# EasyEDA Pro project ProProject_单路无刷驱动版 BLDC_2023-12-23.epro, schematic Schematic1_4

## Sheets
1 CTRL
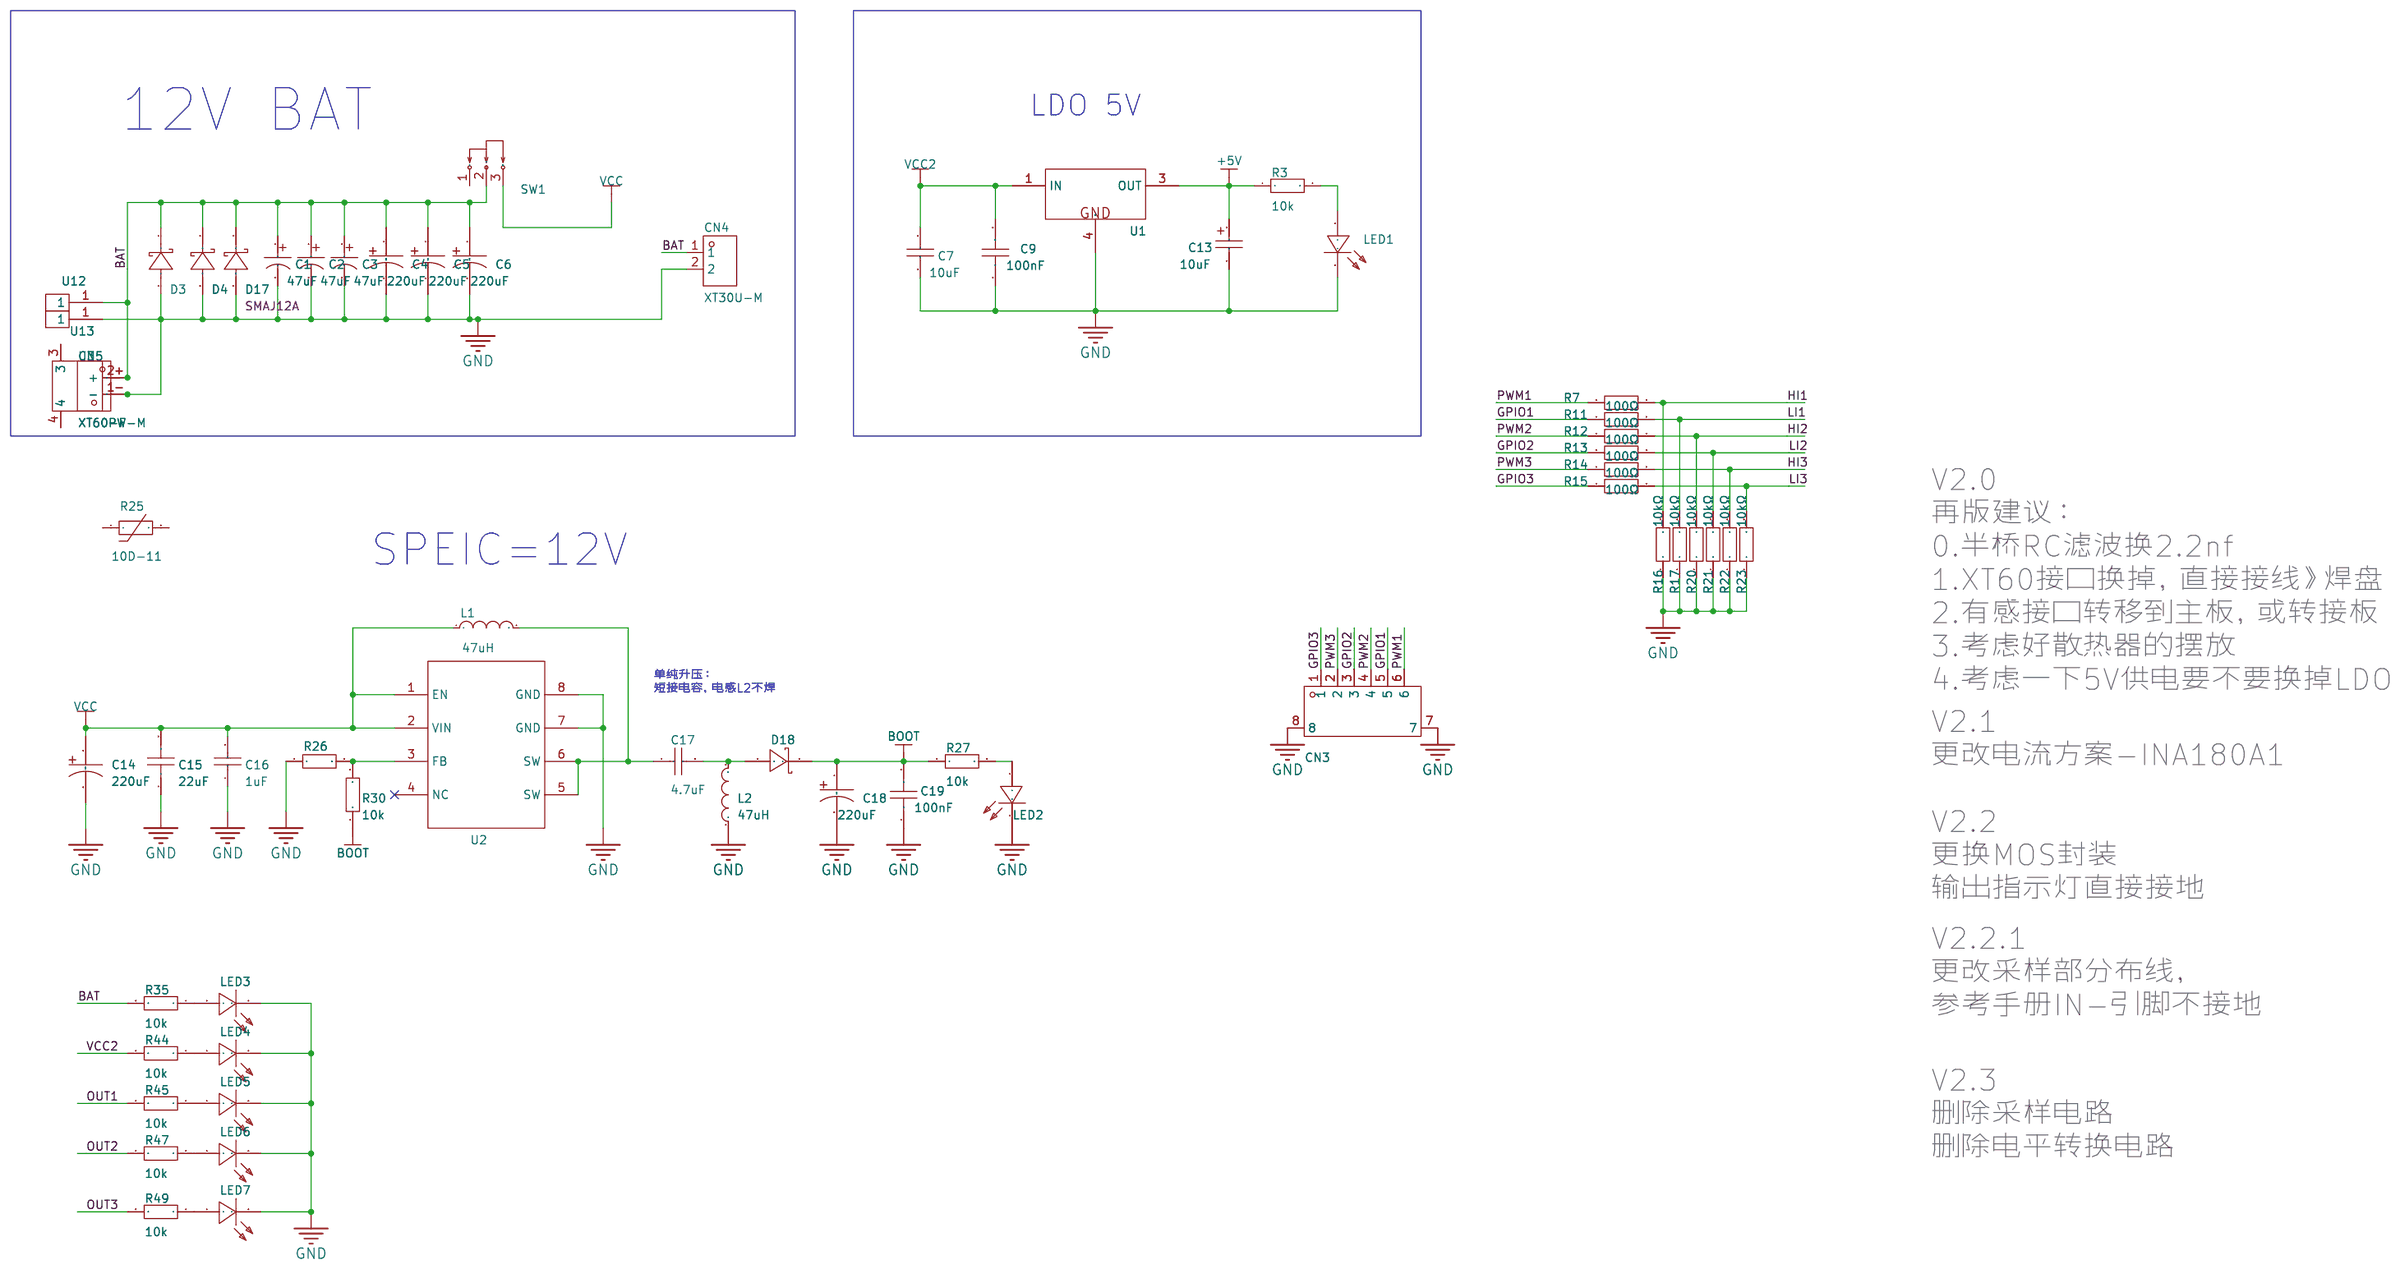
[diagram p0: CTRL]
2 PWR
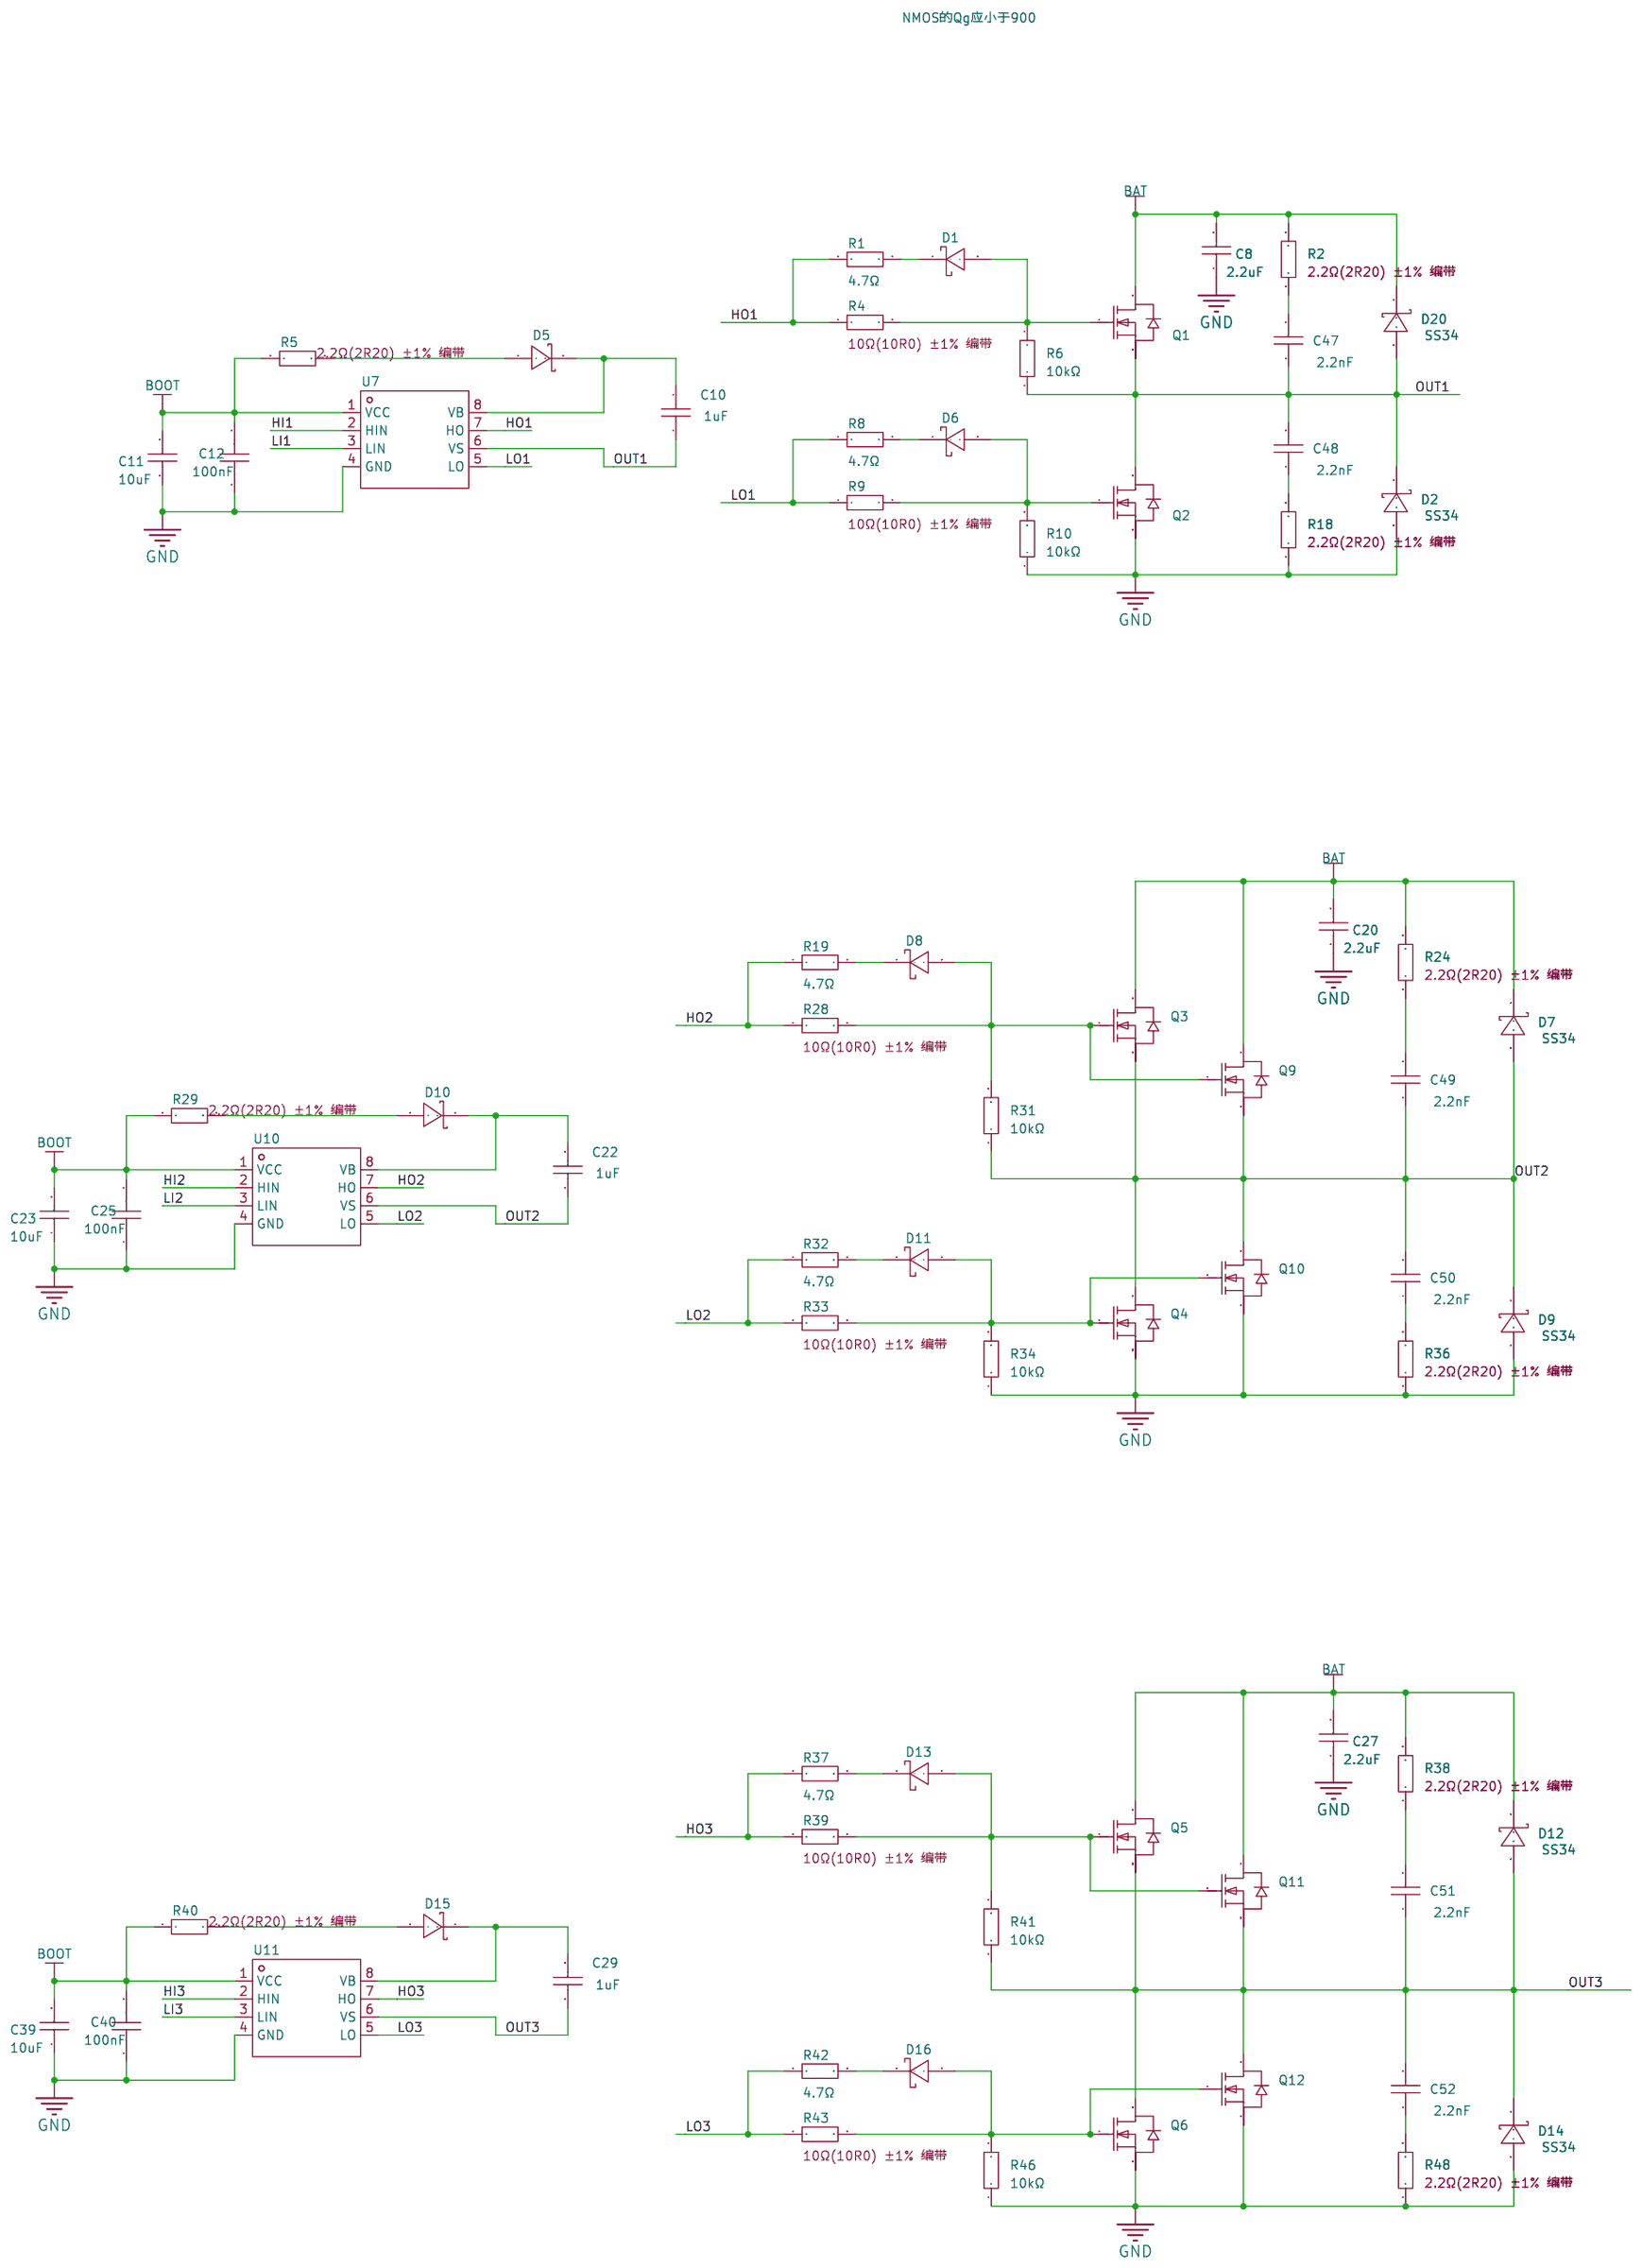
[diagram p1: PWR]

## Parts
sheet CTRL
C1  47uF  [CAP-TH_BD6.3-P2.50-D0.5-FD]
C2  47uF  [CAP-TH_BD6.3-P2.50-D0.5-FD]
C3  47uF  [CAP-TH_BD6.3-P2.50-D0.5-FD]
C4  220uF  [CAP-TH_BD8.0-P3.50-D0.6-FD]  (no BOM)
C5  220uF  [CAP-TH_BD8.0-P3.50-D0.6-FD]  (no BOM)
C6  220uF  [CAP-TH_BD8.0-P3.50-D0.6-FD]  (no BOM)
C7  10uF  [C0805]
C9  100nF  [C0603_1]
C13  10uF  [CAP-SMD_L3.2-W1.6-RD-C7171]
C14  220uF  [CAP-TH_BD8.0-P3.50-D0.6-FD]  (no BOM)
C15  22uF  [C0805]
C16  1uF  [C0603]
C17  4.7uF  [C1206]
C18  220uF  [CAP-TH_BD8.0-P3.50-D0.6-FD]  (no BOM)
C19  100nF  [C0603_1]
CN3  KH-ZH1.5WF-06A  [CONN-SMD_KH-ZH1.5WF-06A]
CN4  XT30U-M  [CONN-TH_XT30U-M]
CN5  XT60PW-M  [CONN-TH_XT60PW-M]
D3  SMAJ12A  [DO-214AC_L4.3-W2.7-LS5.0-RD]  (no BOM)
D4  SMAJ12A  [DO-214AC_L4.3-W2.7-LS5.0-RD]  (no BOM)
D17  SMAJ12A  [DO-214AC_L4.3-W2.7-LS5.0-RD]  (no BOM)
D18  SS210  [SMA_L4.3-W2.6-LS5.2-RD]
L1  47uH  [IND-SMD_L7.3-W6.6]  (no BOM)
L2  47uH  [IND-SMD_L7.3-W6.6]  (no BOM)
LED1  KT-0603R  [LED0603-R-RD]
LED2  KT-0603R  [LED0603-R-RD]
LED3  KT-0603R  [LED0603-R-RD]
LED4  KT-0603R  [LED0603-R-RD]
LED5  KT-0603R  [LED0603-R-RD]
LED6  KT-0603R  [LED0603-R-RD]
LED7  KT-0603R  [LED0603-R-RD]
R3  10k  [R0603]
R7  100Ω  [R0603]
R11  100Ω  [R0603]
R12  100Ω  [R0603]
R13  100Ω  [R0603]
R14  100Ω  [R0603]
R15  100Ω  [R0603]
R16  10kΩ  [R0603]
R17  10kΩ  [R0603]
R20  10kΩ  [R0603]
R21  10kΩ  [R0603]
R22  10kΩ  [R0603]
R23  10kΩ  [R0603]
R25  10D-11  [10D-11自制]
R26  0603WAF1201T5E  [R0603]
R27  10k  [R0603]
R30  10k  [R0603]
R35  10k  [R0603]
R44  10k  [R0603]
R45  10k  [R0603]
R47  10k  [R0603]
R49  10k  [R0603]
SW1  SS12D10G4 071  [SW-TH_SHOU-HAN_SS12D10G4]
U1  L78M05ABDT-TR  [TO-252-2_L6.5-W6.1-P4.58-LS10.0-TL]
U2  XL6007E1  [SOIC-8_L5.0-W4.0-P1.27-LS6.0-BL]  (no BOM)
U3  XT60-F  [CONN-TH_XT60PB-F]
U12  -  [焊盘]
U13  -  [焊盘]
sheet PWR
C8  2.2uF  [C0805]
C10  1uF  [C0805]
C11  10uF  [C0805]
C12  100nF  [C0603_1]
C20  2.2uF  [C0805]
C22  1uF  [C0805]
C23  10uF  [C0805]
C25  100nF  [C0603_1]
C27  2.2uF  [C0805]
C29  1uF  [C0805]
C39  10uF  [C0805]
C40  100nF  [C0603_1]
C47  2.2nF  [C0603]
C48  2.2nF  [C0603]
C49  2.2nF  [C0603]
C50  2.2nF  [C0603]
C51  2.2nF  [C0603]
C52  2.2nF  [C0603]
D1  B5819W SL  [SOD-123_L2.7-W1.6-LS3.7-RD-1]
D2  SS34  [DO-214AC_L4.3-W2.7-LS5.3-RD]
D5  SS210  [SMA_L4.3-W2.6-LS5.2-RD]
D6  B5819W SL  [SOD-123_L2.7-W1.6-LS3.7-RD-1]
D7  SS34  [DO-214AC_L4.3-W2.7-LS5.3-RD]
D8  B5819W SL  [SOD-123_L2.7-W1.6-LS3.7-RD-1]
D9  SS34  [DO-214AC_L4.3-W2.7-LS5.3-RD]
D10  SS210  [SMA_L4.3-W2.6-LS5.2-RD]
D11  B5819W SL  [SOD-123_L2.7-W1.6-LS3.7-RD-1]
D12  SS34  [DO-214AC_L4.3-W2.7-LS5.3-RD]
D13  B5819W SL  [SOD-123_L2.7-W1.6-LS3.7-RD-1]
D14  SS34  [DO-214AC_L4.3-W2.7-LS5.3-RD]
D15  SS210  [SMA_L4.3-W2.6-LS5.2-RD]
D16  B5819W SL  [SOD-123_L2.7-W1.6-LS3.7-RD-1]
D20  SS34  [DO-214AC_L4.3-W2.7-LS5.3-RD]
Q1  HYG011N04LS1TA  [PG-HSOF-8_L10.4-W9.9-P1.2-LS11.7-TL-1]
Q2  HYG011N04LS1TA  [PG-HSOF-8_L10.4-W9.9-P1.2-LS11.7-TL-1]
Q3  HYG011N04LS1TA  [PG-HSOF-8_L10.4-W9.9-P1.2-LS11.7-TL-1]
Q4  HYG011N04LS1TA  [PG-HSOF-8_L10.4-W9.9-P1.2-LS11.7-TL-1]
Q5  HYG011N04LS1TA  [PG-HSOF-8_L10.4-W9.9-P1.2-LS11.7-TL-1]
Q6  HYG011N04LS1TA  [PG-HSOF-8_L10.4-W9.9-P1.2-LS11.7-TL-1]
Q9  HYG011N04LS1TA  [PG-HSOF-8_L10.4-W9.9-P1.2-LS11.7-TL-1]
Q10  HYG011N04LS1TA  [PG-HSOF-8_L10.4-W9.9-P1.2-LS11.7-TL-1]
Q11  HYG011N04LS1TA  [PG-HSOF-8_L10.4-W9.9-P1.2-LS11.7-TL-1]
Q12  HYG011N04LS1TA  [PG-HSOF-8_L10.4-W9.9-P1.2-LS11.7-TL-1]
R1  4.7Ω  [R0603]
R2  0603WAF220KT5E  [R0603]
R4  0603WAF100JT5E  [R0603]
R5  0603WAF220KT5E  [R0603]
R6  10kΩ  [R0603]
R8  4.7Ω  [R0603]
R9  0603WAF100JT5E  [R0603]
R10  10kΩ  [R0603]
R18  0603WAF220KT5E  [R0603]
R19  4.7Ω  [R0603]
R24  0603WAF220KT5E  [R0603]
R28  0603WAF100JT5E  [R0603]
R29  0603WAF220KT5E  [R0603]
R31  10kΩ  [R0603]
R32  4.7Ω  [R0603]
R33  0603WAF100JT5E  [R0603]
R34  10kΩ  [R0603]
R36  0603WAF220KT5E  [R0603]
R37  4.7Ω  [R0603]
R38  0603WAF220KT5E  [R0603]
R39  0603WAF100JT5E  [R0603]
R40  0603WAF220KT5E  [R0603]
R41  10kΩ  [R0603]
R42  4.7Ω  [R0603]
R43  0603WAF100JT5E  [R0603]
R46  10kΩ  [R0603]
R48  0603WAF220KT5E  [R0603]
U7  EG3112  [SOIC-8_L4.9-W3.9-P1.27-LS6.0-BL]  (no BOM)
U10  EG3112  [SOIC-8_L4.9-W3.9-P1.27-LS6.0-BL]  (no BOM)
U11  EG3112  [SOIC-8_L4.9-W3.9-P1.27-LS6.0-BL]  (no BOM)

## Library data of the parts
C1-C3 = 50YXM47MEFRT16.3X11: 容值:47uF;精度:±20%;额定电压:50V;; LCSC Part Name: 47uF 50V; Supplier Part: C702470; Manufacturer: rubycon(红宝石); Supplier Footprint: 径向引线,φ16.3x11mm; Datasheet: https://atta.szlcsc.com/upload/public/pdf/source/20210615/C2839477_48CF283245795451CD7F8C876A7A250B.pdf; Supplier: LCSC; Tolerance: ±20%; Rated Voltage: 50V
C4-C6 C14 C18 = RZW471M1EBK-0815: 容值:470uF;精度:±20%;额定电压:25V;电容体直径:8mm;电容体长度:15mm;脚间距:3.5mm;工作寿命:7000hrs@105;工作温度:-;; LCSC Part Name: 470uF ±20% 25V; Supplier Part: C335050; Manufacturer: lelon(台湾立隆); Supplier Footprint: 径向引线,8x15mm; Datasheet: https://atta.szlcsc.com/upload/public/pdf/source/20181120/C335050_51DA6CA8493D35BF3B1E9837637D07CE.pdf; Supplier: LCSC; Tolerance: ±20%; Rated Voltage: 25V; φD: 8mm; L: 15mm; Lead Spacing: 3.5mm; Lifetime @ Temp: 7000hrs@105; JLCPCB Part Class: Extended Part
C7 C11 C23 C39 = CL21A106KAYNNNE: 容值:10uF;精度:±10%;额定电压:25V;温度系数:X5R;; LCSC Part Name: 10uF ±10% 25V; Supplier Part: C15850; Manufacturer: SAMSUNG(三星); Supplier Footprint: 0805; Datasheet: https://atta.szlcsc.com/upload/public/pdf/source/20160103/1457707679302.pdf; Supplier: LCSC; Tolerance: ±10%; Voltage Rated: 25V; Temperature Coefficient: X5R; JLCPCB Part Class: Basic Part
C9 C12 C19 C25 C40 = CC0603KRX7R9BB104_1: 容值:100nF;精度:±10%;额定电压:50V;温度系数:X7R;; LCSC Part Name: 100nF ±10% 50V; Supplier Part: C14663; Manufacturer: YAGEO(国巨); Manufacturer Part: CC0603KRX7R9BB104; Supplier Footprint: 0603; Datasheet: https://atta.szlcsc.com/upload/public/pdf/source/20170116/1484561234239.pdf; Supplier: LCSC; Tolerance: ±10%; Voltage Rated: 50V; Temperature Coefficient: X7R; JLCPCB Part Class: Basic Part
C13 = TAJA106K016RNJ: 容值:10uF;精度:±10%;额定电压:16V;等效串联电阻:3Ω@100kHz;工作温度:-55~+125;; LCSC Part Name: 10uF ±10% 16V; Supplier Part: C7171; Manufacturer: Kyocera AVX; Supplier Footprint: CASE-A_3216; JLCPCB Part Class: 基础库; Datasheet: https://atta.szlcsc.com/upload/public/pdf/source/20160107/1457707748093.pdf; Supplier: LCSC; Tolerance: ±10%; Rated Voltage: 16V; Equivalent Series Resistance(ESR): 3Ω@100kHz; Operating Temperature: -55~+125
C15 = CL21A226MAQNNNE_C45783: 容值:22uF;精度:±20%;额定电压:25V;温度系数:X5R;; LCSC Part Name: 22uF ±20% 25V; Supplier Part: C45783; Manufacturer: SAMSUNG(三星); Manufacturer Part: CL21A226MAQNNNE; Supplier Footprint: 0805; JLCPCB Part Class: 基础库; Datasheet: https://atta.szlcsc.com/upload/public/pdf/source/20160103/1457707727161.pdf; Supplier: LCSC; Tolerance: ±20%; Voltage Rated: 25V; Temperature Coefficient: X5R
C16 = CL10A105KB8NNNC: 温度系数:X5R;精度:±10%;额定电压:50V;容值:1uF;; LCSC Part Name: 1uF(105) ±10% 50V; Supplier Part: C15849; Manufacturer: SAMSUNG(三星); Supplier Footprint: 0603; JLCPCB Part Class: 基础库; Datasheet: https://atta.szlcsc.com/upload/public/pdf/source/20160103/1457707679084.pdf; Supplier: LCSC; Temperature Coefficient: X5R; Tolerance: ±10%; Voltage Rated: 50V
C17 = 1206B475K500NT: 容值:4.7uF;精度:±10%;额定电压:50V;温度系数:X7R;; LCSC Part Name: 4.7uF ±10% 50V; Supplier Part: C29823; Manufacturer: FH(风华); Supplier Footprint: 1206; JLCPCB Part Class: 基础库; Datasheet: https://atta.szlcsc.com/upload/public/pdf/source/20170923/C29823_1506149432461988716.pdf; Supplier: LCSC; Tolerance: ±10%; Voltage Rated: 50V; Temperature Coefficient: X7R
CN3 = KH-ZH1.5WF-06A: 参考系列:-;间距:1.5mm;插针结构:1x6P;排数:1;每排PIN数:6;行距:-;公母:公型插针;安装方式:卧贴;额定电流:500mA;工作温度范围:-25℃~+85℃;; LCSC Part Name: 6P 1.5mm; Supplier Part: C2688783; Manufacturer: kinghelm(金航标); Supplier Footprint: SMD,P=1.5mm; JLCPCB Part Class: 扩展库; Datasheet: https://atta.szlcsc.com/upload/public/pdf/source/20210202/C2688783_C9B428B3014D7ABB89BDB1FE60180D57.pdf; Supplier: LCSC; Pitch: 1.5mm; Pins Structure: 1x6P; Number of Rows: 1; Number of PINs Per Row: 6; Gender: 公型插针; Mounting Style: 卧贴; Current Rating (Max): 500mA; Operating Temperature Range: -25℃~+85℃
CN4 = XT30U-M: 模型插头轻量版锂电池插头; LCSC Part Name: AMASS(艾迈斯)轻量版锂电池插头公头 XT30U-M; Supplier Part: C99101; Manufacturer: AMASS(艾迈斯); JLCPCB Part Class: Extended Part; Datasheet: https://atta.szlcsc.com/upload/public/pdf/source/20170606/1496716542582.pdf; Supplier: LCSC
CN5 = XT60PW-M: 模型锂电连接器; LCSC Part Name: AMASS(艾迈斯)航模插头xt90连接器150公母对接pw锂电池公头 板插卧式XT60PW-M; Supplier Part: C98732; Manufacturer: AMASS(艾迈斯); JLCPCB Part Class: Extended Part; Datasheet: https://atta.szlcsc.com/upload/public/pdf/source/20180125/C98732_15168617837851301983.pdf; Supplier: LCSC
D3 D4 D17 = SMAJ12A_C2760874: 极性:单向;反向截止电压(Vrwm):12V;击穿电压(最小值):13.3V;击穿电压(最大值):14.7V;反向漏电流(Ir):5A;峰值脉冲电流(Ipp)@10/1000s:20.1A;最大钳位电压:19.9V;峰值脉冲功率(Ppp)@10/1000s:400W;; LCSC Part Name: 单向 12V 400W; Supplier Part: C2760874; Manufacturer: Slkor(萨科微); Supplier Footprint: DO-214AC; JLCPCB Part Class: 扩展库; Datasheet: https://atta.szlcsc.com/upload/public/pdf/source/20200225/C488404_33CF829A6BE74AA3BA3BAD7F337BBDC5.pdf; Supplier: LCSC; Polarity: 单向; Reverse Stand-Off Voltage (Vrwm): 12V; Breakdown Voltage (Min): 13.3V; Breakdown Voltage (Max): 14.7V; Reverse Leakage Current (Ir): 5A; Peak Pulse Current (Ipp)@10/1000μs: 20.1A; Maximum Clamping Voltage: 19.9V; Peak Pulse Power Dissipation (Ppp)@10/1000μs: 400W
D5 D10 D15 D18 = SS210_C14996: 直流反向耐压(Vr):100V;平均整流电流(Io):2A;正向压降(Vf):850mV@2A;; LCSC Part Name: 100V 2A 850mV@2A; Supplier Part: C14996; Manufacturer: MDD; Supplier Footprint: SMA(DO-214AC); JLCPCB Part Class: 基础库; Datasheet: https://atta.szlcsc.com/upload/public/pdf/source/20190304/C14996_C9642665EC53B919CC87DB9E28DB3D1C.pdf; Supplier: LCSC; Reverse Voltage (Vr): 100V; Average Rectified Current (Io): 2A; Forward Voltage (Vf@If): 850mV@2A
L1 L2 = CKST0603-47uH/M: 电感值:47uH;精度:±20%;额定电流:-;饱和电流(Isat):2A;直流电阻(DCR):-;; LCSC Part Name: 47uH ±20% 2A; Supplier Part: C3002643; Manufacturer: CENKER(岑科); Supplier Footprint: 0603; Datasheet: https://atta.szlcsc.com/upload/public/pdf/source/20220510/B48FE89972EB9627500571FF6CB43AFA.pdf; Supplier: LCSC; Tolerance: ±20%; Saturation Current (Isat): 2A
LED1-LED7 = KT-0603R: 发光颜色:红灯;二极管配置:-;透镜颜色:-;主波长:-;峰值波长:-;色温:-;光通量(25时):-;测试电流:-;正向电压(VF):-;发光强度:-;功率:-;发光角度:-;安装方式:-;工作温度:-40~+85;; LCSC Part Name: 红灯; Supplier Part: C2286; Manufacturer: KENTO; Supplier Footprint: 0603; JLCPCB Part Class: 基础库; Datasheet: https://atta.szlcsc.com/upload/public/pdf/source/20160616/1466072038404.pdf; Supplier: LCSC; Emitted Color: 红灯; Operating Temperature: -40~+85
R3 R27 R30 R35 R44 R45 R47 R49 = 0603WAF1002T5E: 电阻类型:厚膜电阻;阻值:10k;精度:±1%;功率:1/10W;温度系数:±100ppm/;最大工作电压:75V;工作温度范围:-55~+155;; LCSC Part Name: 10k ±1%; Supplier Part: C25804; Manufacturer: UNI-ROYAL(厚声); Supplier Footprint: 0603; Datasheet: https://atta.szlcsc.com/upload/public/pdf/source/20200306/C422600_1E6D84923E4A46A82E41ADD87F860B5C.pdf; Supplier: LCSC; Type: 厚膜电阻; Tolerance: ±1%; Power(Watts): 1/10W; Temperature Coefficient: ±100ppm/; Overload Voltage (Max): 75V; Operating Temperature Range: -55~+155; JLCPCB Part Class: Basic Part
R7 R11-R15 = 0603WAF1000T5E_1: 电阻类型:厚膜电阻;阻值:100Ω;精度:±1%;功率:100mW;温度系数:±200ppm/℃;最大工作电压:75V;工作温度范围:-55℃~+155℃;; LCSC Part Name: 100Ω ±1% 100mW; Supplier Part: C22775; Manufacturer: UNI-ROYAL(厚声); Manufacturer Part: 0603WAF1000T5E; Supplier Footprint: 0603; JLCPCB Part Class: 基础库; Datasheet: https://atta.szlcsc.com/upload/public/pdf/source/20200306/C422600_1E6D84923E4A46A82E41ADD87F860B5C.pdf; Supplier: LCSC; Type: 厚膜电阻; Tolerance: ±1%; Power(Watts): 100mW; Temperature Coefficient: ±200ppm/℃; Overload Voltage (Max): 75V; Operating Temperature Range: -55℃~+155℃
R16 R17 R20-R23 = 0603WAF1002T5E_1: 电阻类型:厚膜电阻;阻值:10kΩ;精度:±1%;功率:100mW;温度系数:±100ppm/℃;最大工作电压:75V;工作温度范围:-55℃~+155℃;; LCSC Part Name: 10kΩ ±1% 100mW; Supplier Part: C25804; Manufacturer: UNI-ROYAL(厚声); Manufacturer Part: 0603WAF1002T5E; Supplier Footprint: 0603; JLCPCB Part Class: 基础库; Datasheet: https://atta.szlcsc.com/upload/public/pdf/source/20200306/C422600_1E6D84923E4A46A82E41ADD87F860B5C.pdf; Supplier: LCSC; Type: 厚膜电阻; Tolerance: ±1%; Power(Watts): 100mW; Temperature Coefficient: ±100ppm/℃; Overload Voltage (Max): 75V; Operating Temperature Range: -55℃~+155℃
R25 = 10D-11_C2909130: 阻值(25℃):10Ω;电阻精度:±20%;B值精度:-;B值(25℃/50℃):-;功率:-;最大稳态电流(25℃):3A;B值(25℃/75℃):-;B值(25℃/85℃):-;B值(25℃/100℃):-;工作温度:-40℃~+175℃;; LCSC Part Name: 10Ω 电阻精度:±20%; Supplier Part: C2909130; Manufacturer: VDR(嵩隆); Supplier Footprint: 直插,P=7.5mm; JLCPCB Part Class: 扩展库; Datasheet: https://atta.szlcsc.com/upload/public/pdf/source/20211025/412E31D87326935D0B13BB3F89D7A775.pdf; Supplier: LCSC; Resistance @ 25℃: 10Ω; Resistance Tolerance: ±20%; Steady State Current (Max): 3A; Operating Temperature: -40℃~+175℃
R26 = 0603WAF1201T5E: LCSC Part Name: 1.2KΩ(1201) ±1% 编带; Supplier Part: C22765; Manufacturer: UNI-ROYAL(厚声); Supplier Footprint: 0603; JLCPCB Part Class: 基础库; Datasheet: https://atta.szlcsc.com/upload/public/pdf/source/20170920/C22765_1505887453653980563.pdf; Supplier: LCSC
SW1 = SS12D10G4 071: 立式两档拨动,单排3脚插件,12.7x6.7x6.4,黑柄4MM; Supplier Part: C2887259; Manufacturer: SHOU HAN(首韩); Supplier Footprint: 插件; JLCPCB Part Class: 扩展库; Datasheet: https://atta.szlcsc.com/upload/public/pdf/source/20210820/80D1704BBF3FCEE0435FCAA54C61E0A3.pdf; Supplier: LCSC
U1 = L78M05ABDT-TR: 输出类型:固定;输出极性:正;输出通道数:1;最大输入电压:35V;输出电压:5V;压差:-;输出电流:500mA;电源纹波抑制比(PRSS):62dB@(120Hz);; LCSC Part Name: Vin=35V Vout=5V 500mA 62dB@(120Hz); Supplier Part: C58069; Manufacturer: ST(意法半导体); Supplier Footprint: TO-252-2(DPAK); JLCPCB Part Class: 基础库; Datasheet: https://atta.szlcsc.com/upload/public/pdf/source/20150912/1457707362652.pdf; Supplier: LCSC; Output Type: 固定; Output Polarity: 正; Number of Outputs: 1; Maximum Input Voltage: 35V; Output Voltage: 5V; Output Current: 500mA; Power Supply Rejection Ratio (PRSS): 62dB@(120Hz)
U2 = XL6007E1: 功能类型:升降压型;同步整流:否;输出通道数:1;拓扑结构:升压式；降压-升压式;输入电压:3.6V~24V;输出电压:60V;输出电流(最大值):2A;开关频率:400kHz;; LCSC Part Name: 升降压型 3.6V~24V 2A 400kHz; Supplier Part: C73334; Manufacturer: XLSEMI(芯龙); Supplier Footprint: SOIC-8_150mil; JLCPCB Part Class: 扩展库; Datasheet: https://atta.szlcsc.com/upload/public/pdf/source/20160514/1463194849805.pdf; Supplier: LCSC; Function: 升降压型; Synchronous Rectification: 否; Number of Outputs: 1; Topology: 升压式；降压-升压式; Input Voltage: 3.6V~24V; Output Voltage: 60V; Output Current (Max): 2A; Switching Frequency: 400kHz
U3 = XT60-F: 模型锂电连接器; LCSC Part Name: AMASS(艾迈斯)XT60模型插头 3.5mm镀金香蕉头母头 XT60-F; Supplier Part: C98734; Manufacturer: AMASS(艾迈斯); JLCPCB Part Class: 扩展库; Datasheet: https://atta.szlcsc.com/upload/public/pdf/source/20170606/1496716532533.pdf; Supplier: LCSC
U12 U13 = 焊盘_1: Pin Type: IN; _: 3
C8 C20 C27 = 0805F225M500NT: 容值:2.2uF;精度:±20%;额定电压:50V;温度系数:Y5V;; LCSC Part Name: 2.2uF ±20% 50V; Supplier Part: C49217; Manufacturer: FH(风华); Supplier Footprint: 0805; JLCPCB Part Class: 基础库; Datasheet: https://atta.szlcsc.com/upload/public/pdf/source/20170923/C49217_1506149476408988807.pdf; Supplier: LCSC; Tolerance: ±20%; Voltage Rated: 50V; Temperature Coefficient: Y5V
C10 C22 C29 = CL21B105KBFNNNE: 容值:1uF;精度:±10%;额定电压:50V;材质(温度系数):X7R;; LCSC Part Name: 1uF ±10% 50V; Supplier Part: C28323; Manufacturer: SAMSUNG(三星); Supplier Footprint: 0805; JLCPCB Part Class: 基础库; Datasheet: https://atta.szlcsc.com/upload/public/pdf/source/20160103/1457707718219.pdf; Supplier: LCSC; Tolerance: ±10%; Voltage Rated: 50V; Temperature Coefficient: X7R
C47-C52 = 0603B222K500NT: 容值:2.2nF;精度:±10%;额定电压:50V;材质(温度系数):X7R;; LCSC Part Name: 2.2nF ±10% 50V; Supplier Part: C1604; Manufacturer: FH(风华); Supplier Footprint: 0603; JLCPCB Part Class: 基础库; Datasheet: https://atta.szlcsc.com/upload/public/pdf/source/20170923/C1604_1506149289438988405.pdf; Supplier: LCSC; Tolerance: ±10%; Voltage Rated: 50V; Temperature Coefficient: X7R
D1 D6 D8 D11 D13 D16 = B5819W SL: 直流反向耐压(Vr):40V;平均整流电流(Io):1A;正向压降(Vf):600mV@1A;; LCSC Part Name: 40V 1A 600mV@1A; Supplier Part: C8598; Manufacturer: CJ（江苏长电/长晶）; Supplier Footprint: SOD-123; JLCPCB Part Class: 基础库; Datasheet: https://atta.szlcsc.com/upload/public/pdf/source/20170217/1487301580783.pdf; Supplier: LCSC; Reverse Voltage (Vr): 40V; Average Rectified Current (Io): 1A; Forward Voltage (Vf@If): 600mV@1A
D2 D7 D9 D12 D14 D20 = SS34_C8678: 二极管配置:独立式;直流反向耐压(Vr):40V;平均整流电流(Io):3A;正向压降(Vf):550mV@3A;反向电流(Ir):500uA@40V;; LCSC Part Name: 40V 3A 550mV@3A; Supplier Part: C8678; Manufacturer: MDD; Supplier Footprint: SMA(DO-214AC); JLCPCB Part Class: 基础库; Datasheet: https://atta.szlcsc.com/upload/public/pdf/source/20220408/D0396E57A6E83C6AFC0ED25EC9EDE030.pdf; Supplier: LCSC; Diode Configuration: 独立式; Reverse Voltage (Vr): 40V; Average Rectified Current (Io): 3A; Forward Voltage (Vf@If): 550mV@3A; Reverse Leakage Current (Ir): 500uA@40V
Q1-Q6 Q9-Q12 = HYG011N04LS1TA: 类型:N沟道;漏源电压(Vdss):40V;连续漏极电流(Id):320A;功率(Pd):250W;导通电阻(RDS(on)@Vgs,Id):0.9mΩ@10V,50A;阈值电压(Vgs(th)@Id):1.8V@250uA;栅极电荷(Qg@Vgs):44nC@4.5V;输入电容(Ciss@Vds):5.87nF@25V;反向传输电容(Crss@Vds):63pF@25V;工作温度:-55℃~+175℃@(Tj);; LCSC Part Name: N沟道 40V 320A; Supplier Part: C2874971; Manufacturer: HUAYI(华羿微); Supplier Footprint: TOLL; JLCPCB Part Class: 扩展库; Datasheet: https://atta.szlcsc.com/upload/public/pdf/source/20210806/C2874971_EDD0357E05275AC6F64FABAFFAF8ADDD.pdf; Supplier: LCSC; Type: N沟道; Drain Source Voltage (Vdss): 40V; Continuous Drain Current (Id): 320A; Power Dissipation (Pd): 250W; Drain Source On Resistance (RDS(on)@Vgs,Id): 0.9mΩ@10V,50A; Gate Threshold Voltage (Vgs(th)@Id): 1.8V@250uA; Total Gate Charge (Qg@Vgs): 44nC@4.5V; Input Capacitance (Ciss@Vds): 5.87nF@25V; Reverse Transfer Capacitance (Crss@Vds): 63pF@25V; Operating Temperature: -55℃~+175℃@(Tj)
R1 R8 R19 R32 R37 R42 = 0603WAF470KT5E: 电阻类型:厚膜电阻;阻值:4.7Ω;精度:±1%;功率:100mW;温度系数:±400ppm/;最大工作电压:75V;工作温度范围:-55~+155;; LCSC Part Name: 4.7Ω ±1% 100mW; Supplier Part: C23164; Manufacturer: UNI-ROYAL(厚声); Supplier Footprint: 0603; JLCPCB Part Class: 基础库; Datasheet: https://atta.szlcsc.com/upload/public/pdf/source/20200306/C422600_1E6D84923E4A46A82E41ADD87F860B5C.pdf; Supplier: LCSC; Type: 厚膜电阻; Tolerance: ±1%; Power(Watts): 100mW; Temperature Coefficient: ±400ppm/; Overload Voltage (Max): 75V; Operating Temperature Range: -55~+155
R2 R5 R18 R24 R29 R36 R38 R40 R48 = 0603WAF220KT5E: LCSC Part Name: 2.2Ω(2R20) ±1% 编带; Supplier Part: C22939; Manufacturer: UNI-ROYAL(厚声); Supplier Footprint: 0603; JLCPCB Part Class: 基础库; Datasheet: https://atta.szlcsc.com/upload/public/pdf/source/20170920/C22939_1505900994379982327.pdf; Supplier: LCSC
R4 R9 R28 R33 R39 R43 = 0603WAF100JT5E: LCSC Part Name: 10Ω(10R0) ±1% 编带; Supplier Part: C22859; Manufacturer: UNI-ROYAL(厚声); Supplier Footprint: 0603; JLCPCB Part Class: 基础库; Datasheet: https://atta.szlcsc.com/upload/public/pdf/source/20170920/C22859_1505900954295982249.pdf; Supplier: LCSC
R6 R10 R31 R34 R41 R46 = 0603WAF1002T5E: 电阻类型:厚膜电阻;阻值:10kΩ;精度:±1%;功率:100mW;温度系数:±100ppm/;最大工作电压:75V;工作温度范围:-55~+155;; LCSC Part Name: 10kΩ ±1% 100mW; Supplier Part: C25804; Manufacturer: UNI-ROYAL(厚声); Supplier Footprint: 0603; JLCPCB Part Class: 基础库; Datasheet: https://atta.szlcsc.com/upload/public/pdf/source/20200306/C422600_1E6D84923E4A46A82E41ADD87F860B5C.pdf; Supplier: LCSC; Type: 厚膜电阻; Tolerance: ±1%; Power(Watts): 100mW; Temperature Coefficient: ±100ppm/; Overload Voltage (Max): 75V; Operating Temperature Range: -55~+155
U7 U10 U11 = EG3112: 600V，IO+1A/-1.5A，大功率MOS管、IGBT管栅极驱动IC; Supplier Part: C111908; Manufacturer: EG(屹晶微); Supplier Footprint: SOIC-8_150mil; JLCPCB Part Class: 扩展库; Datasheet: https://atta.szlcsc.com/upload/public/pdf/source/20170919/C111908_1505787061763976695.pdf; Supplier: LCSC

## Nets
+5V: C13.1 R3.1 U1.3(OUT)
GND: C1.2 C2.2 C3.2 C4.2 C5.2 C6.2 C7.2 C8.1 C9.1 C11.1 C12.1 C13.2 C14.2 C15.1 C16.1 C18.2 C19.1 C20.1 C23.1 C25.1 C27.1 C39.1 C40.1 CN3.7 CN3.8 CN4.2 CN5.1(-) D2.2(A) D3.2(K) D4.2(K) D9.2(A) D14.2(A) D17.2(K) L2.1 LED1.2(K) LED2.2(K) LED3.2(K) LED4.2(K) LED5.2(K) LED6.2(K) LED7.2(K) Q2.2(S) Q2.3(S) Q2.4(S) Q2.5(S) Q2.6(S) Q2.7(S) Q2.8(S) Q4.2(S) Q4.3(S) Q4.4(S) Q4.5(S) Q4.6(S) Q4.7(S) Q4.8(S) Q6.2(S) Q6.3(S) Q6.4(S) Q6.5(S) Q6.6(S) Q6.7(S) Q6.8(S) Q10.2(S) Q10.3(S) Q10.4(S) Q10.5(S) Q10.6(S) Q10.7(S) Q10.8(S) Q12.2(S) Q12.3(S) Q12.4(S) Q12.5(S) Q12.6(S) Q12.7(S) Q12.8(S) R10.1 R16.1 R17.1 R18.1 R20.1 R21.1 R22.1 R23.1 R26.1 R34.1 R36.1 R46.1 R48.1 U1.4(GND) U2.7(GND) U2.8(GND) U3.-(2) U7.4(GND) U10.4(GND) U11.4(GND) U13.1
VCC: C14.1 C15.2 C16.2 L1.1 SW1.3 U2.1(EN) U2.2(VIN)
VCC2: C7.1 C9.2 R44.2 U1.1(IN)
BAT: C1.1 C2.1 C3.1 C4.1 C5.1 C6.1 C8.2 C20.2 C27.2 CN4.1 CN5.2(+) D3.1(A) D4.1(A) D7.1(K) D12.1(K) D17.1(A) D20.1(K) Q1.9(D) Q3.9(D) Q5.9(D) Q9.9(D) Q11.9(D) R2.2 R24.2 R35.2 R38.2 SW1.2 U3.+(1) U12.1
BOOT: C11.2 C12.2 C18.1 C19.2 C23.2 C25.2 C39.2 C40.2 D18.1(K) R5.1 R27.1 R29.1 R30.1 R40.1 U7.1(VCC) U10.1(VCC) U11.1(VCC)
GPIO1: CN3.5 R11.1
GPIO2: CN3.3 R13.1
GPIO3: CN3.1 R15.1
HI1: R7.2 R16.2 U7.2(HIN)
HI2: R12.2 R20.2 U10.2(HIN)
HI3: R14.2 R22.2 U11.2(HIN)
HO1: R1.1 R4.1 U7.7(HO)
HO2: R19.1 R28.1 U10.7(HO)
HO3: R37.1 R39.1 U11.7(HO)
LI1: R11.2 R17.2 U7.3(LIN)
LI2: R13.2 R21.2 U10.3(LIN)
LI3: R15.2 R23.2 U11.3(LIN)
LO1: R8.1 R9.1 U7.5(LO)
LO2: R32.1 R33.1 U10.5(LO)
LO3: R42.1 R43.1 U11.5(LO)
OUT1: C10.1 C47.1 C48.2 D2.1(K) D20.2(A) Q1.2(S) Q1.3(S) Q1.4(S) Q1.5(S) Q1.6(S) Q1.7(S) Q1.8(S) Q2.9(D) R6.1 R45.2 U7.6(VS)
OUT2: C22.1 C49.1 C50.2 D7.2(A) D9.1(K) Q3.2(S) Q3.3(S) Q3.4(S) Q3.5(S) Q3.6(S) Q3.7(S) Q3.8(S) Q4.9(D) Q9.2(S) Q9.3(S) Q9.4(S) Q9.5(S) Q9.6(S) Q9.7(S) Q9.8(S) Q10.9(D) R31.1 R47.2 U10.6(VS)
OUT3: C29.1 C51.1 C52.2 D12.2(A) D14.1(K) Q5.2(S) Q5.3(S) Q5.4(S) Q5.5(S) Q5.6(S) Q5.7(S) Q5.8(S) Q6.9(D) Q11.2(S) Q11.3(S) Q11.4(S) Q11.5(S) Q11.6(S) Q11.7(S) Q11.8(S) Q12.9(D) R41.1 R49.2 U11.6(VS)
PWM1: CN3.6 R7.1
PWM2: CN3.4 R12.1
PWM3: CN3.2 R14.1
$1N26897: LED2.1(A) R27.2
$1N47865: R26.2 R30.2 U2.3(FB)
$1N55018: C17.2 D18.2(A) L2.2
$1N57788: C17.1 L1.2 U2.5(SW) U2.6(SW)
$1N69500: LED5.1(A) R45.1
$1N69943: LED6.1(A) R47.1
$1N70111: LED7.1(A) R49.1
$1N120688: LED4.1(A) R44.1
$2N2292: D6.1(-) R8.2
$2N2294: C48.1 R18.2
$2N2295: D1.1(-) R1.2
$2N2297: C47.2 R2.1
$2N2308: D6.2(+) Q2.1(G) R9.2 R10.2
$2N2309: D1.2(+) Q1.1(G) R4.2 R6.2
$2N2310: D5.2(A) R5.2
$2N2311: C10.2 D5.1(K) U7.8(VB)
$2N2312: D11.1(-) R32.2
$2N2314: C50.1 R36.2
$2N2315: D8.1(-) R19.2
$2N2317: C49.2 R24.1
$2N2330: D10.2(A) R29.2
$2N2331: C22.2 D10.1(K) U10.8(VB)
$2N2332: D16.1(-) R42.2
$2N2334: C52.1 R48.2
$2N2335: D13.1(-) R37.2
$2N2337: C51.2 R38.1
$2N2350: D15.2(A) R40.2
$2N2351: C29.2 D15.1(K) U11.8(VB)
Net-(D8-2): D8.2(+) Q3.1(G) Q9.1(G) R28.2 R31.2
Net-(D11-2): D11.2(+) Q4.1(G) Q10.1(G) R33.2 R34.2
Net-(D13-2): D13.2(+) Q5.1(G) Q11.1(G) R39.2 R41.2
Net-(D16-2): D16.2(+) Q6.1(G) Q12.1(G) R43.2 R46.2
Net-(LED1-1): LED1.1(A) R3.2
Net-(LED3-1): LED3.1(A) R35.1

Not connected (* = marked no-connect by the designer): CN5 3 4; R25 1 2; SW1 1; U2 4(NC)*

## Notes on the sheets
sheet 1
- 12V BAT
- LDO 5V
- V2.0
  再版建议：
  0.半桥RC滤波换2.2nf
  1.XT60接口换掉，直接接线》焊盘
  2.有感接口转移到主板，或转接板
  3.考虑好散热器的摆放
  4.考虑一下5V供电要不要换掉LDO
- SPEIC=12V
- 单纯升压：
  短接电容，电感L2不焊
- V2.1
  更改电流方案-INA180A1
- V2.2
  更换MOS封装
  输出指示灯直接接地
- V2.2.1
  更改采样部分布线，
  参考手册IN-引脚不接地
- V2.3
  删除采样电路
  删除电平转换电路
sheet 2
- NMOS的Qg应小于900
